# Altium schematic sheet Power.SchDoc
size Letter; SheetNumber: 1; SheetTotal: 4
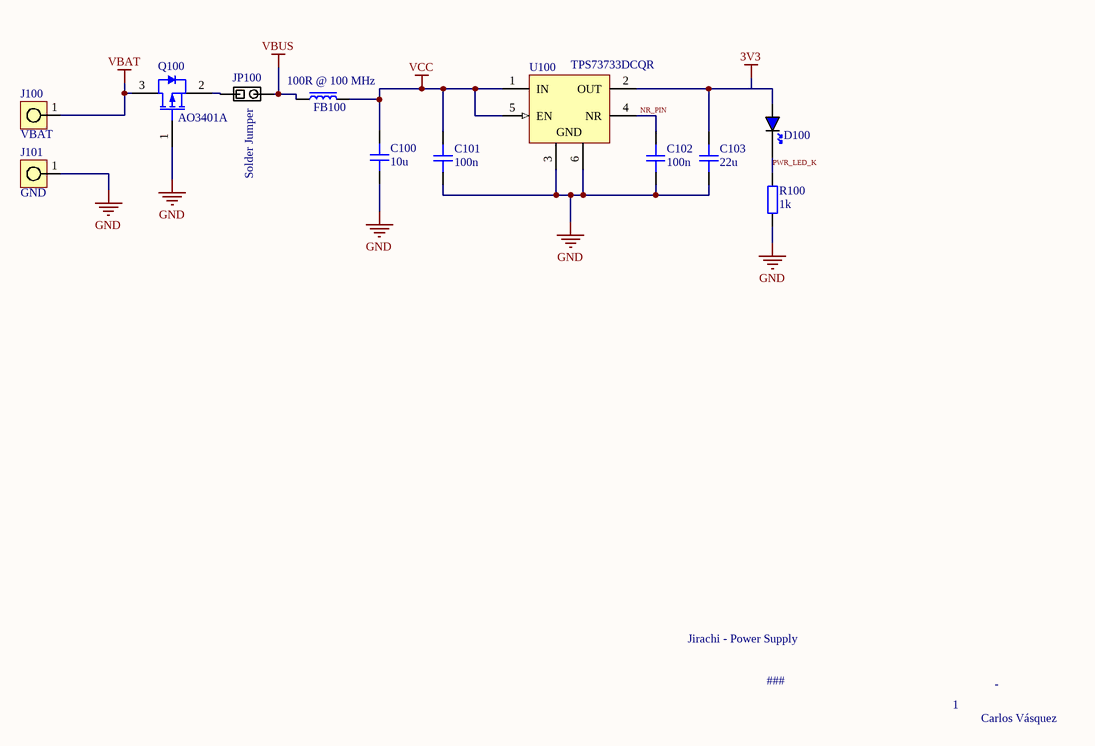
[diagram p0: Power.SchDoc]

## Parts
C100  10u  [CAP_0805]
C101  100n  [CAP_0603]
C102  100n  [CAP_0603]
C103  22u  [CAP_0603]
D100  BLUE  [LED_0805_BLUE]  (value not drawn)
FB100  100R @ 100 MHz  [FB_0805]
J100  VBAT  [SOLDER_PIN_THT_1_5]
J101  GND  [SOLDER_PIN_THT_1_5]
JP100  Solder Jumper  [SolderJumper_Single]
Q100  AO3401A  [AO-SOT-23-3L_V]
R100  1k  [RES_0402]
U100  TPS73733DCQR  [DCQ0006A_N]

## Nets
3V3: C103.2 D100.A U100.2(OUT)
GND: C100.1 C101.1 C102.1 C103.1 J101.1 Q100.1(GATE) R100.1 U100.3(GND) U100.6(GND)
VBAT: J100.1 Q100.3(DRAIN)
VBUS: FB100.1 JP100.2
VCC: C100.2 C101.2 FB100.2 U100.1(IN) U100.5(EN)
NR_PIN: C102.2 U100.4(NR)
PWR_LED_K: D100.K R100.2
NetJP100_1: JP100.1 Q100.2(SOURCE)

## Notes on the sheet
- Jirachi - Power Supply
- ###
- 1
- -
- Carlos Vásquez

## Library data of the parts
C100 = CAP_0805: Capacitor SMD 0805; Manufacturer: *; Manufacturer Part Number: *; Distributor Link: *; LCSC: *; Rating: *; Dielectric: *
C101-C103 = CAP_0603: Capacitor SMD 0603; Manufacturer: *; Manufacturer Part Number: *; Distributor Link: *; LCSC: *; Rating: *; Dielectric: *
D100 = LED_0805_BLUE: LED 0805 BLUE SMD; Manufacturer: *; Manufacturer Part Number: *; Distributor Link: *; LCSC: *
FB100 = FB_0805: Ferrite Bead SMD 0805; Manufacturer: *; Manufacturer Part Number: *; Distributor Link: *; LCSC: *
J100 J101 = SOLDER_PIN_THT: Solder Pin 1.5mm Through-Hole
JP100 = SolderJumper_Single: Solder Jumper Single 0.5mm Pitch
Q100 = CMP-2000-05778-1: P-Channel MOSFET, 30 V, 4 A, -55 to 150 degC, 3-Pin SOT-23-3L, RoHS, Tape and Reel; Manufacturer: Alpha and Omega; Output Power (Max): NotRequiredW; Power Dissipation: 1.4W; Rad Hardened: No; Drain Efficiency: NotRequired%; Drain-Source On-Volt: 30V; Noise Figure: NotRequireddB; Frequency (Max): NotRequiredMHz; Number of  Elements: 1; Gate-Source Voltage (Max): ?12V; Drain Current (Max): 4A; Channel Mode: Enhancement; Drain-Source On-Res: 0.044ohm; Type: PowerMOSFET; Polarity: P; Package URL: http://www.aosmd.com/res/packaging_information/SOT-23-3L.pdf; Datasheet URL: http://www.aosmd.com/res/data_sheets/AO3401A.pdf; Package Type: SOT-23; Package Description: 3-Pin Small Outline Transistor, Body 2.95 x 1.6 mm, Pitch 0.95 mm; Mounting: SurfaceMount; Manufacturer URL: http://www.aosmd.com/; Continuous Drain Current: 4A; Package Reference: SOT-23-3L; Mounting Technology: SurfaceMount; Operating Temperature Classification: Military; Power Gain: NotRequireddB; Datasheet Version: Rev. 3, 03/2011; Operating Temp Range: -55Cto150C; Pin Count: 3
R100 = RES_0402: Resistor SMD 0402; Manufacturer: *; Manufacturer Part Number: *; Distributor Link: *; LCSC: *
U100 = CMP-0395-00300-2: Single Output LDO, 1 A, Fixed 3.3 V Output, 2.2 to 5.5 V Input, with Reverse Current Protection, 6-pin SOT-223 (DCQ), -40 to 125 degC, Green (RoHS & no Sb/Br); Manufacturer: Texas Instruments; Fixed Output Options(V): 3.3; Vdo(Typ)(mV): 130; Iout(Max)(A): 1; Accuracy(%): 3; SubFamily: Single Channel LDO; Vin(Min)(V): 2.2; Vin(Max)(V): 5.5; Rating: Catalog; Iq(Typ)(mA): 0.3; PartNumber: TPS73733DCQR; DatasheetVersion: SBVS067O; PackageReference: DCQ0006A; ComponentLink3URL: http://www.ti.com/litv/pdf/mpds098c; ComponentLink2Description: Datasheet; PackageDescription: 6-Pin Plastic Small Outline, Body 3.5 x 6.5 mm, Pitch 1.27 mm; ComponentLink2URL: http://www.ti.com/general/docs/lit/getliterature.tsp?genericPartNumber=TPS73733&fileType=pdf; PackageVersion: 4202109/D; Vout Adj(Min)(V): 3.3; Vout Adj(Max)(V): 3.3; Eco-Plan: Green (RoHS & no Sb/Br); ComponentLink3Description: Package Specification; Mounting Technology: Surface Mount; ComponentLink1URL: http://www.ti.com/; ComponentLink1Description: Manufacturer URL